# Altium schematic sheet Audio-Beamformer_Supply_V1.0.SchDoc: Audio-Beamformer
size A4; PageSetup: Record=PageOptions|CenterHorizontal=True|CenterVertical=True|PrintScale=0.97|XCorrection=1.00|YCorrection=1.00|PrintKind=0|BorderSize=5000000|LeftOffset=0|BottomOffset=0|Orientation=2|PaperLength=1000|PaperWidth=1000|Scale=100|PaperSource=7|PrintQuality=-3|MediaType=1|DitherType=10|PrintScaleMode=1|PaperKind=A4|PaperIndex=9; Organization: Ostschweizer Fachhochschule; Address2: Florian Baumgartner & Thierry Schwaller; Address3: florian.baumgartner@ost.ch; DocumentNumber: 2; Revision: V1.0; SheetNumber: 2; SheetTotal: 10; Author: Florian Baumgartner & Thierry Schwaller; Subtitle: Power Supply
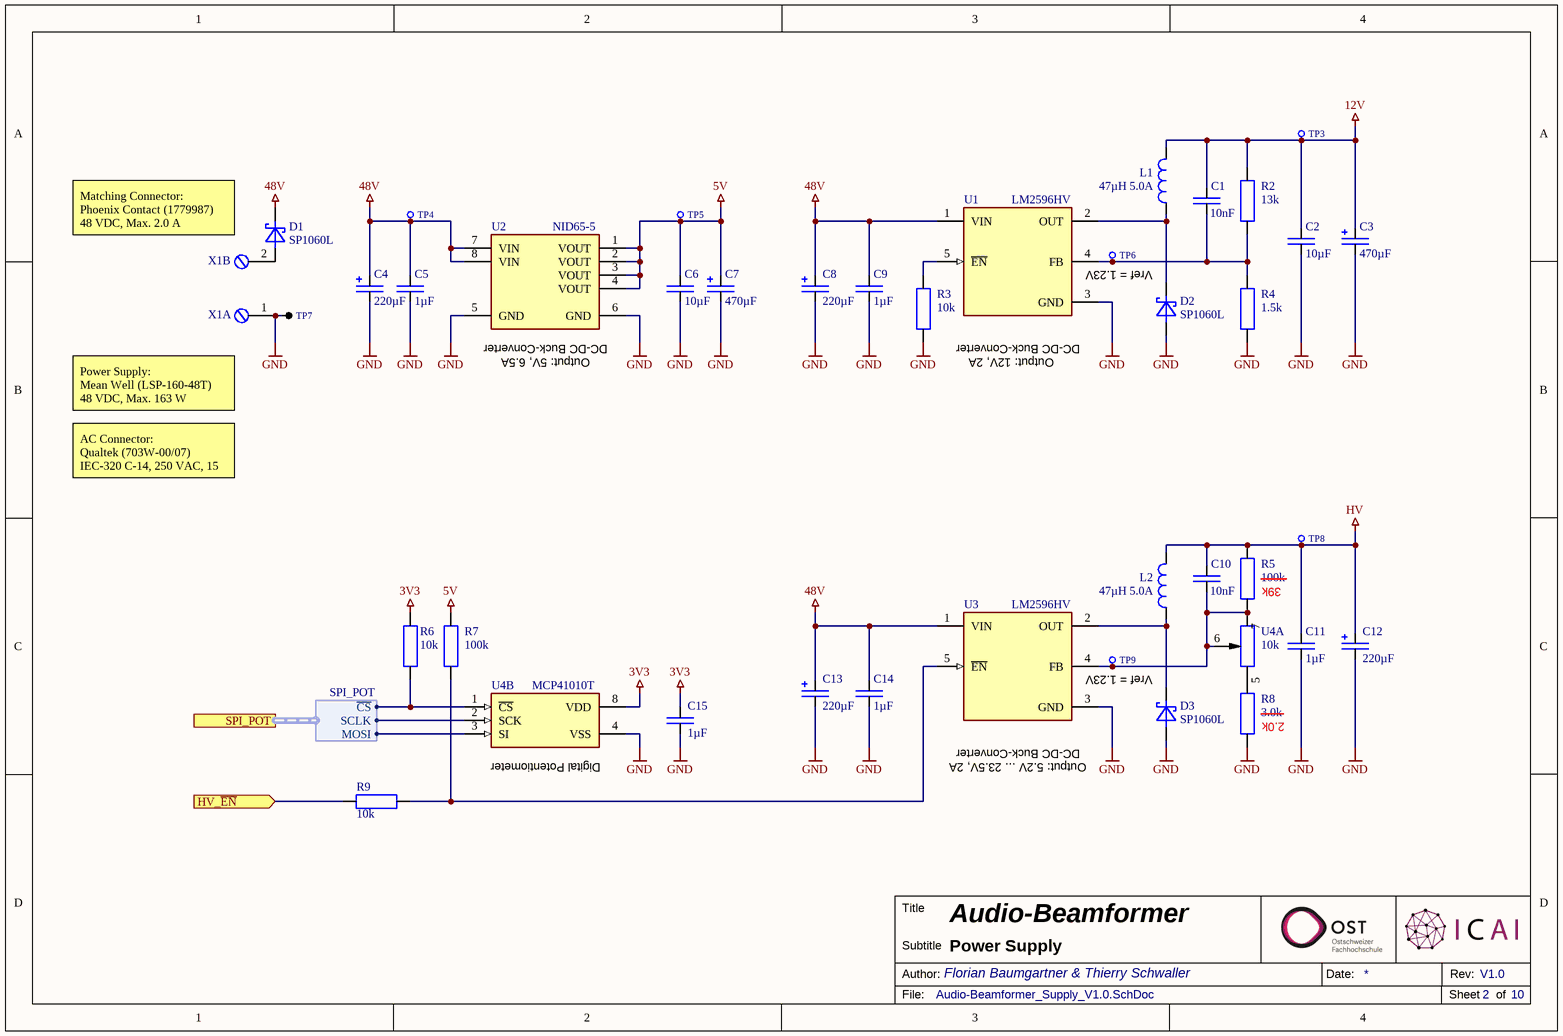
[diagram p0: Audio-Beamformer_Supply_V1.0.SchDoc]

## Parts
C1  10nF  [SMD Keramikkondensator 0603]
C2  10µF  [SMD Keramikkondensator 1206]
C3  470µF  [SMD Elko 10.0x10.0]
C4  220µF  [SMD Elko 12.5x13.5]
C5  1µF  [SMD Keramikkondensator 1206]
C6  10µF  [SMD Keramikkondensator 1206]
C7  470µF  [SMD Elko 10.0x10.0]
C8  220µF  [SMD Elko 12.5x13.5]
C9  1µF  [SMD Keramikkondensator 1206]
C10  10nF  [SMD Keramikkondensator 0603]
C11  1µF  [SMD Keramikkondensator 1206]
C12  220µF  [SMD Elko 12.5x13.5]
C13  220µF  [SMD Elko 12.5x13.5]
C14  1µF  [SMD Keramikkondensator 1206]
C15  1µF  [SMD Keramikkondensator 0603]
D1  SP1060L  [SMD Diode TO-277]
D2  SP1060L  [SMD Diode TO-277]
D3  SP1060L  [SMD Diode TO-277]
L1  47µH 5.0A  [SMD Inductor 13.8x12.6x6.5]
L2  47µH 5.0A  [SMD Inductor 13.8x12.6x6.5]
R2  13k  [SMD Widerstand 0603]
R3  10k  [SMD Widerstand 0603]
R4  1.5k  [SMD Widerstand 0603]
R5  100k  [SMD Widerstand 0603]
R6  10k  [SMD Widerstand 0603]
R7  100k  [SMD Widerstand 0603]
R8  3.0k  [SMD Widerstand 0603]
R9  10k  [SMD Widerstand 0603]
TP3  X-TP  [THT Testpunkt Ø1mm]  (value not drawn)  (no BOM)
TP4  X-TP  [THT Testpunkt Ø1mm]  (value not drawn)  (no BOM)
TP5  X-TP  [THT Testpunkt Ø1mm]  (value not drawn)  (no BOM)
TP6  X-TP  [THT Testpunkt Ø1mm]  (value not drawn)  (no BOM)
TP7  Schwarz  [THT Messpunkt Ø2.54mm Schwarz]  (value not drawn)
TP8  X-TP  [THT Testpunkt Ø1mm]  (value not drawn)  (no BOM)
TP9  X-TP  [THT Testpunkt Ø1mm]  (value not drawn)  (no BOM)
U1  LM2596HV  [SMD IC TO-263-5]
U2  NID65-5  [THT DC-DC-Converter (NID65-X)]
U3  LM2596HV  [SMD IC TO-263-5]
U4  MCP41010T  [SMD IC SOIC-8]  (value not drawn)  (parts A,B of 2)
X1  X-Klemme (2-Pol)  [THT Schraubklemme Steckbar 2-Pol (1757242)]  (value not drawn)  (parts A,B of 2)

## Ports
HV_~{EN} (in), SPI_POT (harness SPI_POT)

## Harnesses
SPI_POT: SCLK, MOSI, ~{CS}

## Nets
3V3: C15.2 R6.2 U4.8(NC)
5V: C6.2 C7.P(+) R7.2 TP5.1 U2.1(VOUT) U2.2(VOUT) U2.3(VOUT) U2.4(VOUT)
12V: C1.2 C2.2 C3.P(+) L1.1 R2.2 TP3.1
48V: C4.P(+) C5.2 C8.P(+) C9.2 C13.P(+) C14.2 D1.K TP4.1 U1.1(VIN) U2.7(VIN) U2.8(VIN) U3.1(VIN)
GND: C2.1 C3.M(-) C4.M(-) C5.1 C6.1 C7.M(-) C8.M(-) C9.1 C11.1 C12.M(-) C13.M(-) C14.1 C15.1 D2.A D3.A R3.1 R4.2 R8.2 TP7.1 U1.3(GND) U2.5(GND) U2.6(GND) U3.3(GND) U4.4(VSS) X1.1
HV: C10.2 C11.2 C12.P(+) L2.1 R5.2 TP8.1
HV_~{EN}: R9.2 ; port HV_~{EN}
NetC1_1: C1.1 R2.1 R4.1 TP6.1 U1.4(FB)
NetC10_1: C10.1 R5.1 TP9.1 U3.4(FB) U4.6(M) U4.7(NC)
NetD1_A: D1.A X1.2
NetD2_K: D2.K L1.2 U1.2(OUT)
NetD3_K: D3.K L2.2 U3.2(OUT)
NetR3_2: R3.2 U1.5(~{EN})
NetR6_1: R6.1 U4.1(~{CS}) ; port SPI_POT.~{CS}
NetR7_1: R7.1 R9.1 U3.5(~{EN})
NetR8_1: R8.1 U4.5(H)
NetU4_2: U4.2(SCK) ; port SPI_POT.SCLK
NetU4_3: U4.3(SI) ; port SPI_POT.MOSI

Not connected (* = marked no-connect by the designer): U2 9(NC) 10(NC) 11(NC); U4 9(NC) 12(NC) 13(NC)

## Notes on the sheet
- Matching Connector:
  Phoenix Contact (1779987)
  48 VDC, Max. 2.0 A
- Vref = 1.23V
- (near U2) DC-DC Buck-Converter
- (near U2) Output: 5V, 6.5A
- Output: 12V, 2A
- DC-DC Buck-Converter
- Power Supply:
  Mean Well (LSP-160-48T)
  48 VDC, Max. 163 W
- AC Connector:
  Qualtek (703W-00/07)
  IEC-320 C-14, 250 VAC, 15 A
- 10k
- (near R5) 39k
- (near U4) Digital Potentiometer
- (near U3) DC-DC Buck-Converter
- Output: 5.2V ... 23.5V, 2A
- (near R8) 2.0k
- Title
- Author:
- Subtitle
- Date:
- Rev:
- File:
- Sheet
- of

## Library data of the parts
C1 C10 = E6 - 10nF: SMD Ceramic Capacitor E6; Component Value: 10nF 50V; Component Description: Multilayer Ceramic Capacitors MLCC; ComponentLink1Description: Datasheet; ComponentLink1URL: https://datasheet.lcsc.com/lcsc/2102081402_FH-Guangdong-Fenghua-Advanced-Tech-0603B103K500NT_C57112.pdf; Digikey: 478-3700-1-ND; Farnell: 1833876; JLC-Parts: C57112; Mouser: 581-06031C103J; Unit Price: 0.01
C2 C6 = C-CAPACITOR: CAP-MK; Component Description: Multilayer Ceramic Capacitors; Component Value: 10µF 50V; Digikey: 445-7886-1-ND; Farnell: 2211092; Mouser: 810-CGA5L3X5R1H106K; JLC-Parts: C13585; Unit Price: 0.27
C3 C7 = C-ELCAP: CAP-Elko; Component Description: Electrolytic Capacitor; Component Value: 470µF 25V; Mouser: 140-VEJ471M1ETR1010; JLC-Parts: C176672; Unit Price: 0.17
C4 C8 C12 C13 = C-ELCAP: CAP-Elko; Component Description: Electrolytic Capacitor; Component Value: 220µF 63V; JLC-Parts: C249502; Unit Price: 0.42
C5 C9 C11 C14 = C-CAPACITOR: CAP-MK; Component Description: Multilayer Ceramic Capacitors; Component Value: 1µF 100V; Digikey: 720-VJ1206Y104MXBATCT-ND; Farnell: 1657939; Mouser: 77-VJ1206Y104MXBAT; JLC-Parts: C91151; Unit Price: 0.01
C15 = E6 - 1uF: SMD Ceramic Capacitor E6; Component Value: 1µF 50V; Component Description: Multilayer Ceramic Capacitors MLCC; ComponentLink1Description: Datasheet; ComponentLink1URL: https://datasheet.lcsc.com/lcsc/1810261812_Samsung-Electro-Mechanics-CL10A105KB8NNNC_C15849.pdf; Digikey: 1276-1860-1-ND; Farnell: 3013383; JLC-Parts: C15849; Mouser: 187-CL10A105KB8NNNC; Unit Price: 0.01
D1-D3 = R-DIODE:SCHKY: S-DIODE; Component Description: Low Voltage Schottky-Diode; JLC-Parts: C2693399; ComponentLink1Description: Datasheet; ComponentLink1URL: https://datasheet.lcsc.com/lcsc/2103051837_Changjiang-Electronics-Tech--CJ-SP1060L_C2693399.pdf; Component Value: SP1060L; Unit Price: 0.32
L1 L2 = L-COIL: Shielded Power Inductor; ComponentLink1Description: Datasheet; ComponentLink1URL: https://datasheet.lcsc.com/lcsc/2003172239_YJYCOIN-YSPI1365-470M_C497913.pdf; Digikey: 118-SRP1265WA-470MCT-ND; Farnell: 3929029; JLC-Parts: C497913; Mouser: 652-SRP1265WA-470M; Component Description: Shielded Power Inductor; Component Value: 47µH 5.0A; Unit Price: 0.68
R2 = R-RESISTOR: RES (E=Heizwiderstand B=Messwandler); Component Description: Thick Film Chip Resistor; Component Value: 13k (75V, 100mW, 1%); Digikey: P13.0KHCT-ND; Farnell: 2059416; Mouser: 667-ERJ-3EKF1302V; JLC-Parts: C22797; Unit Price: 0.01
R3 R6 R9 = R-RESISTOR: RES (E=Heizwiderstand B=Messwandler); Component Description: Thick Film Chip Resistor; Component Value: 10k (75V, 100mW, 1%); Digikey: P10.0KHCT-ND; Farnell: 2303192; Mouser: 667-ERJ-3EKF1002V; JLC-Parts: C25804; Unit Price: 0.01
R4 = R-RESISTOR: RES (E=Heizwiderstand B=Messwandler); Component Description: Thick Film Chip Resistor; Component Value: 1.5k (75V, 100mW, 1%); Digikey: P1.50KHCT-ND; Farnell: 2303156; Mouser: 667-ERJ-3EKF1501V; JLC-Parts: C22843; Unit Price: 0.01
R5 R7 = R-RESISTOR: RES (E=Heizwiderstand B=Messwandler); Component Description: Thick Film Chip Resistor; Component Value: 100k (75V, 100mW, 1%); Digikey: P100KHCT-ND; Farnell: 2303232; Mouser: 667-ERJ-3EKF1003V; JLC-Parts: C25803; Unit Price: 0.01
R8 = R-RESISTOR: RES (E=Heizwiderstand B=Messwandler); Component Description: Thick Film Chip Resistor; Component Value: 3.0k (75V, 100mW, 1%); Digikey: P3.00KHCT-ND; Farnell: 2059357; Mouser: 667-ERJ-3EKF3001V; JLC-Parts: C4211; Unit Price: 0.01
TP3-TP6 TP8 TP9 = X-TP: Testpunkt; Component Description: Testpoint; Component Value: Ø 0.8mm; Unit Price: 0.00
TP7 = X-MP: Messpunkt; Component Description: Ground-Clip; Component Value: Ø 2.54mm (Black); Digikey: 36-5001-ND; Farnell: 2301278; Mouser: 534-5001; Unit Price: 0.36
U1 U3 = U-LM2596HV: High Power Switching Buck Converter; Component Value: LM2596HVS-ADJ/TR; ComponentLink1Description: Datasheet; ComponentLink1URL: https://datasheet.lcsc.com/lcsc/2006151006_HTC-Korea-TAEJIN-Tech-LM2596HVGR-ADJ_C508705.pdf; JLC-Parts: C356713; Unit Price: 1.71; Component Description: High Power Switching Buck Converter
U2 = U-NID65-5: High Power Switching Buck Converter; ComponentLink1Description: Datasheet; ComponentLink1URL: https://www.meanwellusa.com/webapp/product/search.aspx?prod=NID65#1; Digikey: NID65-5-ND; Component Value: NID65-5; Farnell: 3253319; Mouser: 709-NID65-5; Unit Price: 16.40; Component Description: High Power Switching Buck Converter
U4 = U-MCP41010T: Component Description: Digital-Potentiometer 8-Bit; Component Value: MCP41010T-I/SN (10k); ComponentLink1Description: Datasheet; ComponentLink1URL: https://datasheet.lcsc.com/lcsc/1806121747_Microchip-Tech-MCP41010T-I-SN_C136395.pdf; Digikey: MCP41010T-I/SNCT-ND; Farnell: 2857765; JLC-Parts: C136395; Mouser: 579-MCP41010T-I/SN; Unit Price: 2.70
X1 = X-Klemme (2-Pol): Component Description: Screw Terminal (Pluggable); Component Value: 1757242 (2-Pol, 320V, 12A, 5.08mm); Digikey: 277-1106-ND; Farnell: 3705171; Mouser: 651-1757242; ComponentLink1Description: Datasheet; ComponentLink1URL: https://www.mouser.ch/datasheet/2/324/4/1757242-1440624.pdf; Unit Price: 0.66